# EAGLE board Mini_VFD_RevA (EAGLE 9.6.2)
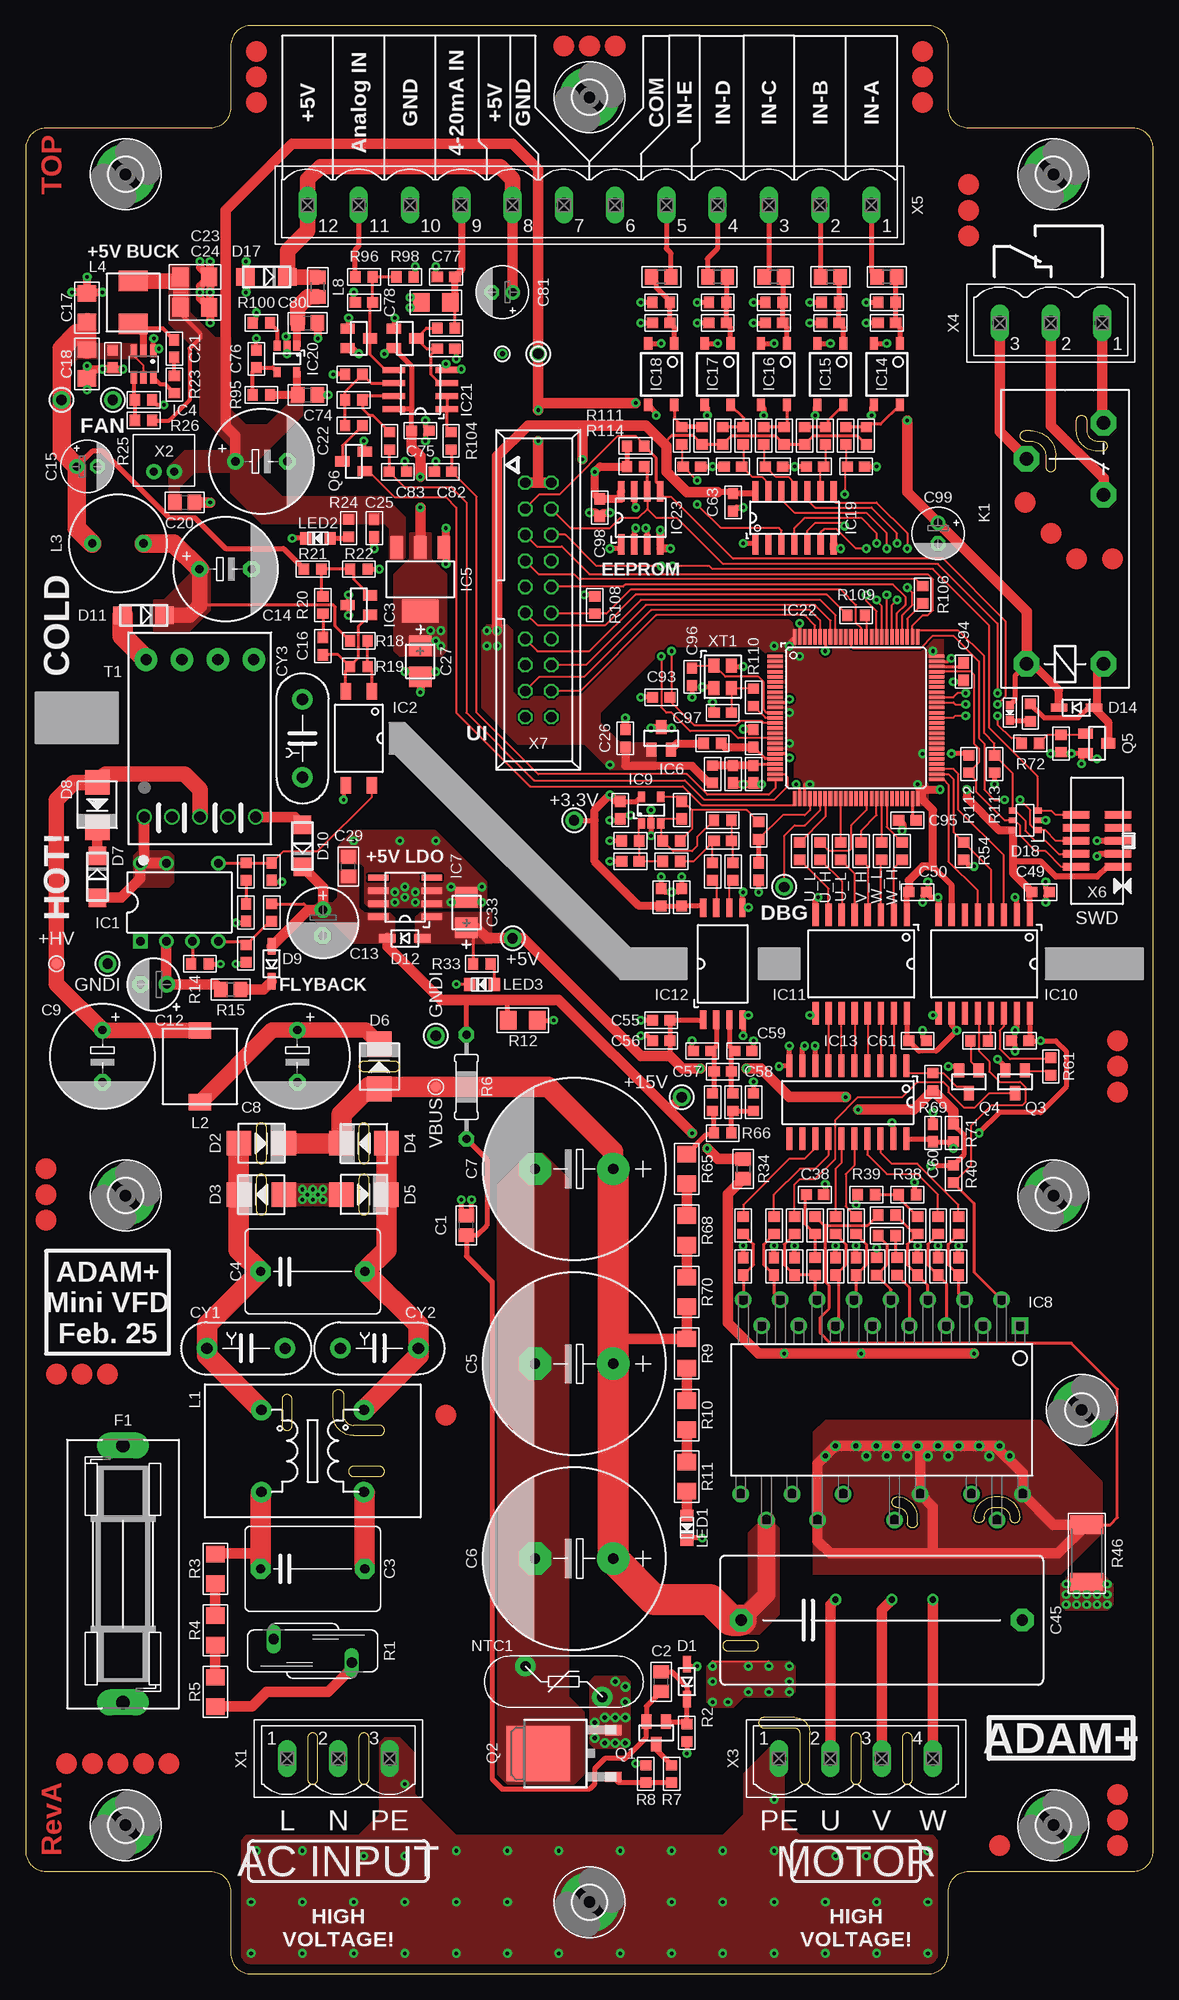
[diagram p7: board, top side]
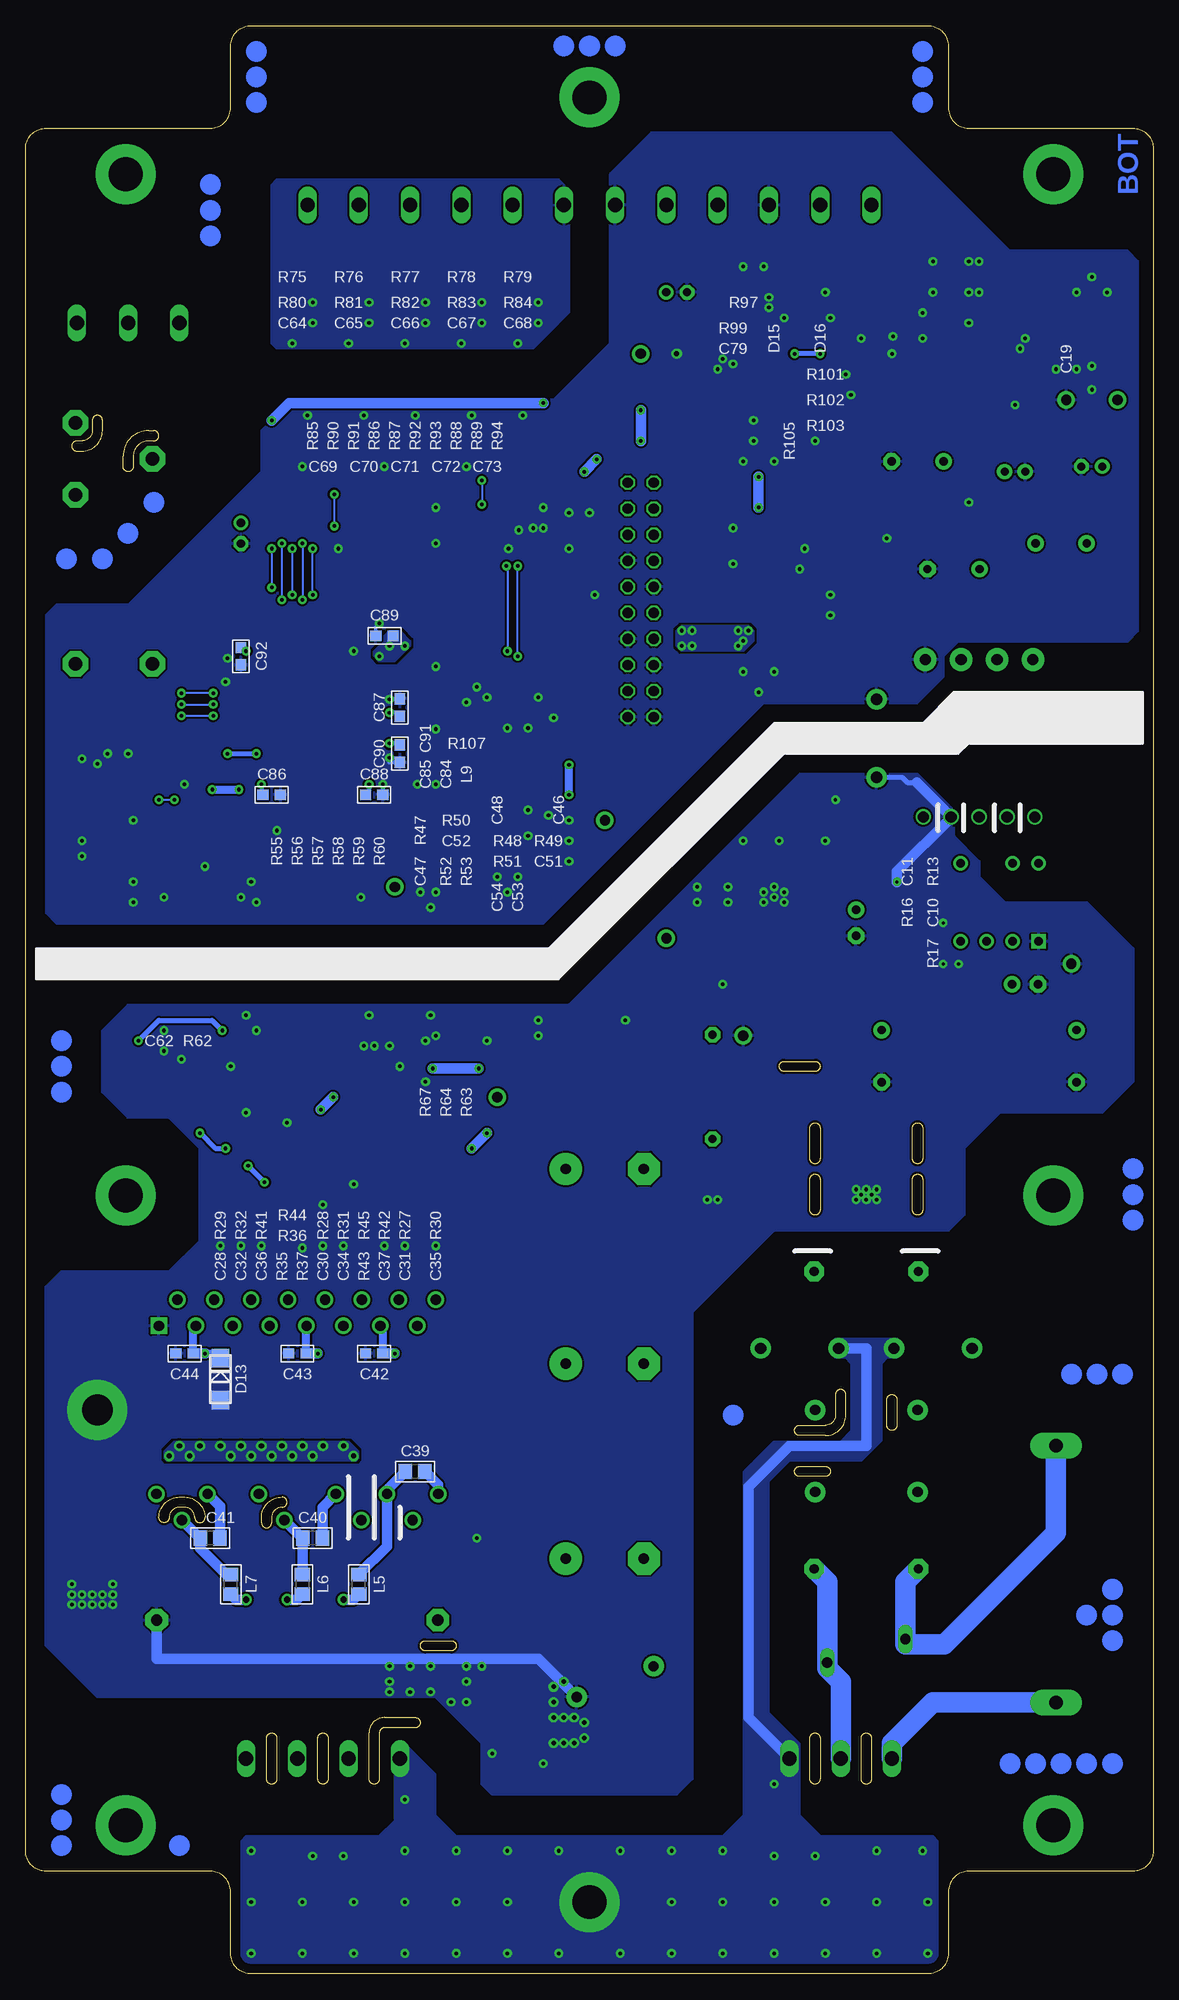
[diagram p8: board, bottom side, seen from below]

Size 110 x 190 mm. Coordinates in mm from the lower left corner, seen from the top.
Outline: 0,12 arc90 2,10 18,10 arc-90 20,8 20,2 arc90 22,0 88,0 arc90 90,2 90,8 arc-90 92,10 108,10 arc90 110,12 110,178 arc90 108,180 92,180 arc-90 90,182 90,188 arc90 88,190 22,190 arc90 20,188 20,182 arc-90 18,180 2,180 arc90 0,178 0,12
Outline: 32,48.5 34.5,48.5 arc90 35,49 arc90 34.5,49.5 32,49.5 arc90 31.5,49 arc90 32,48.5
Outline: 32,52.5 34.5,52.5 arc90 35,53 arc90 34.5,53.5 32,53.5 arc-90 31,54.5 31,56.5 arc90 30.5,57 arc90 30,56.5 30,54.5 arc90 32,52.5
Outline: 26,53.5 26,56 arc90 25.5,56.5 arc90 25,56 25,53.5 arc90 25.5,53 arc90 26,53.5
Outline: 68.5,31.5 71,31.5 arc90 71.5,32 arc90 71,32.5 68.5,32.5 arc90 68,32 arc90 68.5,31.5
Outline: 72,24 75,24 arc-90 75.5,23.5 75.5,19 arc90 76,18.5 arc90 76.5,19 76.5,23.5 arc90 75,25 72,25 arc90 71.5,24.5 arc90 72,24
Outline: 93.5,44.5 arc-90 93,44 arc-90 92.5,44.5 arc-90 94.5,46.5 95,46.5 arc-90 97,44.5 arc-90 96.5,44 arc-90 96,44.5 arc90 95,45.5 94.5,45.5 arc90 93.5,44.5
Outline: 85,45.5 arc-90 84.5,46 arc-90 85,46.5 arc-90 87,44.5 87,44 arc-90 86.5,43.5 arc-90 86,44 86,44.5 arc90 85,45.5
Outline: 23.5,79.5 23.5,82.5 arc90 23,83 arc90 22.5,82.5 22.5,79.5 arc90 23,79 arc90 23.5,79.5
Outline: 23.5,74.5 23.5,77.5 arc90 23,78 arc90 22.5,77.5 22.5,74.5 arc90 23,74 arc90 23.5,74.5
Outline: 33,88 36,88 arc90 36.5,88.5 arc90 36,89 33,89 arc90 32.5,88.5 arc90 33,88
Outline: 33.5,79.5 33.5,82.5 arc90 33,83 arc90 32.5,82.5 32.5,79.5 arc90 33,79 arc90 33.5,79.5
Outline: 33.5,74.5 33.5,77.5 arc90 33,78 arc90 32.5,77.5 32.5,74.5 arc90 33,74 arc90 33.5,74.5
Outline: 27.5,23 27.5,19 arc90 28,18.5 arc90 28.5,19 28.5,23 arc90 28,23.5 arc90 27.5,23
Outline: 32.5,23 32.5,19 arc90 33,18.5 arc90 33.5,19 33.5,23 arc90 33,23.5 arc90 32.5,23
Outline: 80.5,23 80.5,19 arc90 81,18.5 arc90 81.5,19 81.5,23 arc90 81,23.5 arc90 80.5,23
Outline: 85.5,23 85.5,19 arc90 86,18.5 arc90 86.5,19 86.5,23 arc90 86,23.5 arc90 85.5,23
Outline: 97.5,149.5 98,149.5 arc-90 99.5,148 99.5,147 arc90 100,146.5 arc90 100.5,147 100.5,148 arc90 98,150.5 97.5,150.5 arc90 97,150 arc90 97.5,149.5
Outline: 103.5,151.5 103.5,150.5 arc90 104.5,149.5 105,149.5 arc-90 105.5,149 arc-90 105,148.5 104.5,148.5 arc-90 102.5,150.5 102.5,151.5 arc-90 103,152 arc-90 103.5,151.5
Copper layers (1*16): Top 0.035mm / dielectric 1.5mm / Bottom 0.035mm
Design rules "PCB-POOL Standard *": minimum track width 0.2mm, minimum drill 0.3mm, track to track 0.2mm, track to pad 0.2mm, pad to pad 0.2mm, via to via 0.2mm, smd to smd 0.2mm, copper to edge 0.25mm, drill to drill 0.2mm, minimum pad ring 0.2mm, minimum via ring 0.25mm, stop-mask expansion 0.03mm, vias tented up to drill 0.5mm, thermal gap 0.2mm
Net classes: 0 default: width 0.15 mm, drill 0.2 mm, clearance 0.2 mm; 1 High_Voltage: width 0.2 mm, drill 0.2 mm, clearance 2.5 mm to class 0, clearance 2.5 mm

## Footprints (pad centres in the part's own frame; a part is rotated, then mirrored left to right if it is on the bottom)
C0805 = smd 1.3 x 1.5: 1 -0.95,0; 2 0.95,0
C102-082X133 = drill 0.9 pad 1.93 octagon: 1 -5.08,0; 2 5.08,0
E7,5-18 = drill 1.016 pad 3.15: + -3.81,0 | drill 1.016 pad 3.15 octagon: - 3.81,0
E5-10,5 = drill 0.8 pad 1.6: + -2.54,0 | drill 0.8 pad 1.6 octagon: - 2.54,0
C0603 = smd 1.1 x 1: 1 -0.85,0; 2 0.85,0
E2,5-5 = drill 0.813 pad 1.6: + -1.27,0 | drill 0.813 pad 1.6 octagon: - 1.27,0
E2,5-7 = drill 0.813 pad 1.6: + -1.27,0 | drill 0.813 pad 1.6 octagon: - 1.27,0
E2-5 = drill 0.8 pad 1.422: + -1.016,0 | drill 0.8 pad 1.422 octagon: - 1.016,0
C1206 = smd 1.6 x 1.8: 1 -1.4,0; 2 1.4,0
CT3528 = smd 2 x 2.2: + -1.5,0; - 1.5,0
C275-126X316 = drill 1.1 pad 2.2 octagon: 1 -13.716,0; 2 13.716,0
YC7B5 = drill 1.1 pad 2: 1 -3.81,0; 2 3.81,0
SOD123 = smd 1.6 x 0.8: 1 -1.7,0; 2 1.7,0
SMB = smd 2.4 x 2.4: A 2.2,0; C -2.2,0
DO214AC = smd 1.8 x 1.7: A 2.05,0; C -2.05,0
SOT23 = smd 1 x 1.4: 1 -0.95,-1.1; 2 0.95,-1.1; 3 0,1.1
TSOP-6 = smd 0.8 x 0.55: 1 -1.2,0.95; 2 -1.2,0; 3 -1.2,-0.95; 4 1.2,-0.95; 5 1.2,0; 6 1.2,0.95
SH25 = drill 1.321 pad 2.54 long: 1 -12.522,0; 2 12.522,0
3,3-PAD = drill 3.3 pad 5.842: B3,3 0,0
3,0-PAD = drill 3 pad 5.842: B3,0 0,0
DIL07 = drill 0.813 pad 1.4 square: 1 -3.81,-3.81 | drill 0.813 pad 1.4: 2 -1.27,-3.81; 3 1.27,-3.81; 4 3.81,-3.81; 5 3.81,3.81; 7 -1.27,3.81; 8 -3.81,3.81
SMD4 = smd 1 x 1.6: 1 -1.27,-4.575; 2 1.27,-4.575; 3 1.27,4.575; 4 -1.27,4.575
TSOT23-6 = smd 0.62 x 1.22: 1 -0.95,-1.3; 2 0,-1.3; 3 0.95,-1.3; 4 0.95,1.3; 5 0,1.3; 6 -0.95,1.3
SOT223 = smd 1.219 x 2.235: 1 -2.311,-3.099; 2 0,-3.099; 3 2.311,-3.099 | smd 3.6 x 2.2: 4 0,3.099
SOIC8 = smd 0.6 x 2: 1 -1.905,-2.6; 2 -0.635,-2.6; 3 0.635,-2.6; 4 1.905,-2.6; 5 1.905,2.6; 6 0.635,2.6; 7 -0.635,2.6; 8 -1.905,2.6
NDIP26_12P45X29P25_STM = drill 1 pad 1.6 square: 1 -8.2,13.5 | drill 1 pad 1.6: 2 -10.74,11.7; 3 -8.2,9.9; 4 -10.74,8.1; 5 -8.2,6.3; 6 -10.74,4.5; 7 -8.2,2.7; 8 -10.74,0.9; 9 -8.2,-0.9; 10 -10.74,-2.7; 11 -8.2,-4.5; 12 -10.74,-6.3; 13 -8.2,-8.1; 14 -10.74,-9.9; 15 -8.2,-11.7; 16 -10.74,-13.5; 17 8.2,-13.75; 18 10.76,-11.25; 19 8.2,-8.75; 20 10.76,-6.25; 21 8.2,-3.75; 22 10.76,1.25; 23 8.2,3.75; 24 8.2,8.75; 25 10.76,11.25; 26 8.2,13.75
SOT23-5 = smd 0.69 x 0.99: 1 -0.95,-1.29; 2 0,-1.29; 3 0.95,-1.29; 4 0.95,1.3; 5 -0.95,1.3
SOIC16R = smd 0.6 x 2.2: 1 -4.445,-4.775; 2 -3.175,-4.775; 3 -1.905,-4.775; 4 -0.635,-4.775; 5 0.635,-4.775; 6 1.905,-4.775; 7 3.175,-4.775; 8 4.445,-4.775; 9 4.445,4.8; 10 3.175,4.8; 11 1.905,4.8; 12 0.635,4.8; 13 -0.635,4.8; 14 -1.905,4.8; 15 -3.175,4.8; 16 -4.445,4.8
SOIC8_W = smd 1.8 x 0.6: 1 -5.45,1.905; 2 -5.45,0.635; 3 -5.45,-0.635; 4 -5.45,-1.905; 5 5.45,-1.905; 6 5.45,-0.635; 7 5.45,0.635; 8 5.45,1.905
SOIC20NS = smd 0.6 x 2.2: 1 -5.715,-3.565; 2 -4.445,-3.565; 3 -3.175,-3.565; 4 -1.905,-3.565; 5 -0.635,-3.565; 6 0.635,-3.565; 7 1.905,-3.565; 8 3.175,-3.565; 9 4.445,-3.565; 10 5.715,-3.565; 11 5.715,3.565; 12 4.445,3.565; 13 3.175,3.565; 14 1.905,3.565; 15 0.635,3.565; 16 -0.635,3.565; 17 -1.905,3.565; 18 -3.175,3.565; 19 -4.445,3.565; 20 -5.715,3.565
SOP04 = smd 0.8 x 1.2: 1 -1.27,-3; 2 1.27,-3; 3 1.27,3; 4 -1.27,3
SO14 = smd 0.6 x 2: 1 -3.81,-2.6; 2 -2.54,-2.6; 3 -1.27,-2.6; 4 0,-2.6; 5 1.27,-2.6; 6 2.54,-2.6; 7 3.81,-2.6; 8 3.81,2.6; 9 2.54,2.6; 10 1.27,2.6; 11 0,2.6; 12 -1.27,2.6; 13 -2.54,2.6; 14 -3.81,2.6
SO08 = smd 0.6 x 2.2: 1 -1.905,-2.6; 2 -0.635,-2.6; 3 0.635,-2.6; 4 1.905,-2.6; 5 1.905,2.6; 6 0.635,2.6; 7 -0.635,2.6; 8 -1.905,2.6
LQFP100 = smd 1.5 x 0.35: 1 -7.875,6; 2 -7.875,5.5; 3 -7.875,5; 4 -7.875,4.5; 5 -7.875,4; 6 -7.875,3.5; 7 -7.875,3; 8 -7.875,2.5; 9 -7.875,2; 10 -7.875,1.5; 11 -7.875,1; 12 -7.875,0.5; 13 -7.875,0; 14 -7.875,-0.5; 15 -7.875,-1; 16 -7.875,-1.5; 17 -7.875,-2; 18 -7.875,-2.5; 19 -7.875,-3; 20 -7.875,-3.5; 21 -7.875,-4; 22 -7.875,-4.5; 23 -7.875,-5; 24 -7.875,-5.5; 25 -7.875,-6; 51 7.875,-6; 52 7.875,-5.5; 53 7.875,-5; 54 7.875,-4.5; 55 7.875,-4; 56 7.875,-3.5; 57 7.875,-3; 58 7.875,-2.5; 59 7.875,-2; 60 7.875,-1.5; 61 7.875,-1; 62 7.875,-0.5; 63 7.875,0; 64 7.875,0.5; 65 7.875,1; 66 7.875,1.5; 67 7.875,2; 68 7.875,2.5; 69 7.875,3; 70 7.875,3.5; 71 7.875,4; 72 7.875,4.5; 73 7.875,5; 74 7.875,5.5; 75 7.875,6 | smd 0.35 x 1.5: 26 -6,-7.875; 27 -5.5,-7.875; 28 -5,-7.875; 29 -4.5,-7.875; 30 -4,-7.875; 31 -3.5,-7.875; 32 -3,-7.875; 33 -2.5,-7.875; 34 -2,-7.875; 35 -1.5,-7.875; 36 -1,-7.875; 37 -0.5,-7.875; 38 0,-7.875; 39 0.5,-7.875; 40 1,-7.875; 41 1.5,-7.875; 42 2,-7.875; 43 2.5,-7.875; 44 3,-7.875; 45 3.5,-7.875; 46 4,-7.875; 47 4.5,-7.875; 48 5,-7.875; 49 5.5,-7.875; 50 6,-7.875; 76 6,7.875; 77 5.5,7.875; 78 5,7.875; 79 4.5,7.875; 80 4,7.875; 81 3.5,7.875; 82 3,7.875; 83 2.5,7.875; 84 2,7.875; 85 1.5,7.875; 86 1,7.875; 87 0.5,7.875; 88 0,7.875; 89 -0.5,7.875; 90 -1,7.875; 91 -1.5,7.875; 92 -2,7.875; 93 -2.5,7.875; 94 -3,7.875; 95 -3.5,7.875; 96 -4,7.875; 97 -4.5,7.875; 98 -5,7.875; 99 -5.5,7.875; 100 -6,7.875
E3206S = drill 1.3 pad 2.5 octagon: 1 -3,3.75; 2 -3,-3.75; O 13.5,-3.75; P 17,3.75; S 20.5,-3.75
CMC_PDMCAT18107 = drill 1 pad 2: IN1 5,-4; IN2 -5,-4; OUT1 5,4; OUT2 -5,4
SLH0704 = smd 1.6 x 2.2: 1 -3.5,0; 2 3.5,0
PDPTAT = drill 0.8 pad 1.6: 1 -2.5,0; 2 2.5,0
DH0530H = smd 2 x 2.8: P$1 -2.1,0; P$2 2.1,0
R0805 = smd 1.3 x 1.5: 1 -0.95,0; 2 0.95,0
R0603 = smd 1 x 1.1: 1 -0.85,0; 2 0.85,0
LED_0805 = smd 1.1 x 1.25: A 1.2,0; C -1.2,0
LED_0603 = smd 0.8 x 0.8: A 0.75,0; C -0.75,0
MF72 = drill 1 pad 2: 1 -3.75,1.5; 2 3.75,-1.5
TO252 = smd 1.016 x 1.6: 1 -2.28,-4.8; 2 2.28,-4.8 | smd 5.4 x 6.2: 3 0,2.5
S10K175 = drill 1.016 long: 1 -1.143,-3.81; 2 1.143,3.81
R1206 = smd 1.6 x 1.803: 1 -1.422,0; 2 1.422,0
0207/10 = drill 0.8 pad 1.5 octagon: 1 -5.08,0; 2 5.08,0
R2512 = smd 1.8 x 3.2: 1 -2.8,0; 2 2.8,0
WE-OLSTM_EE13_L13.72W20.45H10.8 = drill 1.1: 1 -7.675,5.44; 2 -7.675,2.72; 3 -7.675,0; 4 -7.675,-2.72; 5 -7.675,-5.44 | drill 1.1 pad 2.2: 6 7.675,-5.25; 7 7.675,-1.75; 8 7.675,1.75; 9 7.675,5.25
TP10R = smd 1 x 1: TP 0,0
SOLDER_EYE = drill 1 pad 1.7: 1 0,0
MSTBV3 = drill 1.397 long: 1 -5,0; 2 0,0; 3 5,0
DF3A-2P-2DSA = drill 0.8 pad 1.5: 1 1,0; 2 -1,0
MSTBV4 = drill 1.397 long: 1 -7.5,0; 2 -2.5,0; 3 2.5,0; 4 7.5,0
MSTBV12 = drill 1.397 long: 1 -27.5,0; 2 -22.5,0; 3 -17.5,0; 4 -12.5,0; 5 -7.5,0; 6 -2.5,0; 7 2.5,0; 8 7.5,0; 9 12.5,0; 10 17.5,0; 11 22.5,0; 12 27.5,0
3220-10-0300-00 = smd 0.76 x 2.6: 1 -2.54,-2.05; 2 -2.54,2.05; 3 -1.27,-2.05; 4 -1.27,2.05; 5 0,-2.05; 6 0,2.05; 7 1.27,-2.05; 8 1.27,2.05; 9 2.54,-2.05; 10 2.54,2.05
057-020-1 = drill 1 octagon: 1 -11.43,-1.27; 2 -11.43,1.27; 3 -8.89,-1.27; 4 -8.89,1.27; 5 -6.35,-1.27; 6 -6.35,1.27; 7 -3.81,-1.27; 8 -3.81,1.27; 9 -1.27,-1.27; 10 -1.27,1.27; 11 1.27,-1.27; 12 1.27,1.27; 13 3.81,-1.27; 14 3.81,1.27; 15 6.35,-1.27; 16 6.35,1.27; 17 8.89,-1.27; 18 8.89,1.27; 19 11.43,-1.27; 20 11.43,1.27
3225_4P = smd 1.4 x 1.2: 1 -1.1,-0.85; 2 1.1,-0.85; 3 1.1,0.85; 4 -1.1,0.85

## Placement (x,y rotation side)
C1  4.7uF  [C0805]  43,73 90 top
C2  10uF  [C0805]  62,28.5 90 top
C3  1uF  [C102-082X133]  28,39.5 0 top
C4  1uF  [C102-082X133]  28,68.5 0 top
C5  68uF/450V  [E7,5-18]  53.5,59.5 180 top
C6  68uF/450V  [E7,5-18]  53.5,40.5 180 top
C7  68uF/450V  [E7,5-18]  53.5,78.5 180 top
C8  10uF/450V  [E5-10,5]  26.5,89.5 270 top
C9  10uF/450V  [E5-10,5]  7.5,89.5 270 top
C10  220nF  [C0603]  21.5,103.5 270 top
C11  2.7nF  [C0603]  24,107.5 270 top
C12  10uF  [E2,5-5]  12.5,96.5 180 top
C13  47uF  [E2,5-7]  29,102.5 270 top
C14  470uF  [E5-10,5]  19.5,137 0 top
C15  22uF  [E2-5]  6,147 0 top
C16  18nF  [C0603]  29,129.5 90 top
C17  10uF  [C1206]  6,162.5 90 top
C18  10uF  [C1206]  6,157 270 top
C19  100nF  [C0603]  8.5,157.5 270 top
C20  4.7uF  [C0805]  15.5,143.5 0 top
C21  100nF  [C0603]  14.5,158.5 90 top
C22  470uF  [E5-10,5]  23,147.5 0 top
C23  22uF  [C1206]  16.5,165.5 0 top
C24  22uF  [C1206]  16.5,162.5 0 top
C25  4.7uF  [C0603]  34,141 270 top
C26  4.7uF  [C0603]  58.5,120.5 90 top
C27  10uF  [CT3528]  38.5,128 270 top
C28  1nF  [C0603]  91,69 90 top
C29  2.2uF  [C0805]  31.5,108 90 top
C30  1nF  [C0603]  81,69 90 top
C31  1nF  [C0603]  73,69 90 top
C32  1nF  [C0603]  89,69 90 top
C33  10uF  [CT3528]  43,103.5 90 top
C34  1nF  [C0603]  79,69 90 top
C35  1nF  [C0603]  70,69 90 top
C36  33pF  [C0603]  87,69 90 top
C37  2.2nF  [C0603]  75,69 90 top
C38  22nF  [C0603]  77,76 0 top
C39  2.2uF  [C0805]  72,49 180 bottom
C40  2.2uF  [C0805]  82,42.5 180 bottom
C41  2.2uF  [C0805]  92,42.5 180 bottom
C42  100nF  [C0603]  76,60.5 180 bottom
C43  100nF  [C0603]  83.5,60.5 180 bottom
C44  100nF  [C0603]  94.5,60.5 180 bottom
C45  4.7uF  [C275-126X316]  83.5,34.5 0 top
C46  100nF  [C0603]  58,113.5 270 top
C47  100nF  [C0603]  71.5,107.5 270 top
C48  100nF  [C0603]  64,113.5 270 top
C49  100nF  [C0603]  99,105.5 0 top
C50  100nF  [C0603]  87,105.5 0 top
C51  10nF  [C0603]  59,108.5 180 top
C52  10nF  [C0603]  68,110.5 180 top
C53  4.7uF  [C0603]  62,105 90 top
C54  100nF  [C0603]  64,105 90 top
C55  100nF  [C0603]  62,93 180 top
C56  4.7uF  [C0603]  62,91 180 top
C57  10pF  [C0603]  66,90 0 top
C58  10nF  [C0603]  68,88 0 top
C59  10pF  [C0603]  70,90 0 top
C60  100nF  [C0603]  88.5,82 90 top
C61  100nF  [C0603]  87,91 0 top
C62  100nF  [C0603]  97,91 180 top
C63  100nF  [C0603]  69,143.5 270 top
C64  100nF  [C0603]  84,161 180 top
C65  100nF  [C0603]  78.5,161 180 top
C66  100nF  [C0603]  73,161 180 top
C67  100nF  [C0603]  67.5,161 180 top
C68  100nF  [C0603]  62,161 180 top
C69  100nF  [C0603]  81,147 0 top
C70  100nF  [C0603]  77,147 180 top
C71  100nF  [C0603]  73,147 0 top
C72  100nF  [C0603]  69,147 180 top
C73  100nF  [C0603]  65,147 0 top
C74  10uF  [C0805]  27.5,154 0 top
C75  100nF  [C0603]  38.5,150.5 0 top
C76  1uF  [C0603]  22.5,157.5 90 top
C77  100nF  [C0603]  41,165.5 180 top
C78  100nF  [C0603]  33,163 180 top
C79  100nF  [C0603]  41,158.5 0 top
C80  10uF  [C0805]  27.5,161 0 top
C81  22uF  [E2-5]  46.5,164 180 top
C82  100nF  [C0603]  40.7,146.5 180 top
C83  100nF  [C0603]  36.3,146.5 0 top
C84  1uF  [C0603]  69,117 270 top
C85  100nF  [C0603]  71,117 270 top
C86  100nF  [C0603]  86,115 0 bottom
C87  100nF  [C0603]  73.5,123.5 90 bottom
C88  100nF  [C0603]  76,115 0 bottom
C89  100nF  [C0603]  75,130.5 180 bottom
C90  100nF  [C0603]  73.5,119 270 bottom
C91  100nF  [C0603]  71,120.5 90 top
C92  100nF  [C0603]  89,128.5 270 bottom
C93  100nF  [C0603]  62,124.5 180 top
C94  2.2uF  [C0603]  91.5,127 270 top
C95  2.2uF  [C0603]  86,112.5 180 top
C96  10pF  [C0603]  65,126.5 270 top
C97  10pF  [C0603]  68,123 180 top
C98  100nF  [C0603]  56,143 90 top
C99  22uF  [E2-5]  89,140.5 270 top
CY1  2.2nF  [YC7B5]  21.5,61 0 top
CY2  2.2nF  [YC7B5]  34.5,61 0 top
CY3  2.2nF  [YC7B5]  27,120.5 90 top
D1  BAT54J  [SOD123]  64.5,28.5 90 top
D2  STTH3R04U  [SMB]  23,81 180 top
D3  STTH3R04U  [SMB]  23,76 0 top
D4  STTH3R04U  [SMB]  33,81 0 top
D5  STTH3R04U  [SMB]  33,76 180 top
D6  STTH3R04U  [SMB]  34.5,88.5 270 top
D7  PU1JA  [DO214AC]  7,107 270 top
D8  SMBJP6KE200A-TP  [SMB]  7,114 90 top
D9  BAT54J  [SOD123]  24,98.5 90 top
D10  PU1JA  [DO214AC]  27,110 90 top
D11  PU1JA  [DO214AC]  11.5,132.5 180 top
D12  BAT54J  [SOD123]  37,101 0 top
D13  DNP  [DO214AC]  91,58 270 bottom
D14  1N5819W  [SOD123]  102.5,123.5 0 top
D15  BAV99-7-F  [SOT23]  37,159.5 270 top
D16  BAV99-7-F  [SOT23]  32.5,159.5 270 top
D17  6V  [DO214AC]  23.5,165.5 180 top
D18  PESD3V3S5UD,125  [TSOP-6]  97.5,112.5 180 top
F1  5A  [SH25]  9.5,39 90 top
H1  MOUNT-PAD-ROUND3.3  [3,3-PAD]  9.75,175.5 0 top
H2  MOUNT-PAD-ROUND3.3  [3,3-PAD]  55,7 0 top
H3  MOUNT-PAD-ROUND3.3  [3,3-PAD]  55,183 180 top
H4  MOUNT-PAD-ROUND3.3  [3,3-PAD]  100.25,175.5 180 top
H5  MOUNT-PAD-ROUND3.3  [3,3-PAD]  9.75,14.5 0 top
H6  MOUNT-PAD-ROUND3.3  [3,3-PAD]  9.75,75.9 0 top
H7  MOUNT-PAD-ROUND3.3  [3,3-PAD]  100.25,14.5 0 top
H8  MOUNT-PAD-ROUND3.3  [3,3-PAD]  100.25,75.9 0 top
H9  MOUNT-PAD-ROUND3.0  [3,0-PAD]  103,55 0 top
IC1  VIPER06HN  [DIL07]  15,104.5 0 top
IC2  CT817C  [SMD4]  32.5,120.5 180 top
IC3  AN431AN  [SOT23]  32.5,133.5 90 top
IC4  TPS56339  [TSOT23-6]  11.5,157 180 top
IC5  SPX1117M3  [SOT223]  38.5,136 180 top
IC6  REF3025AIDBZR  [SOT23]  62,120.5 0 top
IC7  L78L05A  [SOIC8]  37,105 90 top
IC8  STGIPN3H60  [NDIP26_12P45X29P25_STM]  83.5,55 270 top
IC9  MCP6006U  [SOT23-5]  61,113.5 0 top
IC10  π131E60  [SOIC16R]  93.5,98.5 180 top
IC11  π160E60  [SOIC16R]  81.5,98.5 180 top
IC12  AMC1200  [SOIC8_W]  68,98.5 90 top
IC13  74ACT541  [SOIC20NS]  80.2,85 180 top
IC14  LTV-354T  [SOP04]  84,156 180 top
IC15  LTV-354T  [SOP04]  78.5,156 180 top
IC16  LTV-354T  [SOP04]  73,156 180 top
IC17  LTV-354T  [SOP04]  67.5,156 180 top
IC18  LTV-354T  [SOP04]  62,156 180 top
IC19  SN74LVC14ADR  [SO14]  75,142 0 top
IC20  SY6280AAC  [SOT23-5]  25.5,157.5 180 top
IC21  MCP6272T-E/SN  [SO08]  38.5,154.5 90 top
IC22  STM32F407VGT7  [LQFP100]  81,122.5 0 top
IC23  AT34C04-SS5M-T  [SOIC8]  60,142 0 top
K1  G2RL-1-HA DC5  [E3206S]  101.39,130.75 90 top
L1  22mH  [CMC_PDMCAT18107]  28,51 180 top
L2  1mH  [SLH0704]  17,88.5 270 top
L3  56uH  [PDPTAT]  9,139.5 0 top
L4  5.6uH  [DH0530H]  10.5,163 270 top
L5  BLM21PG331BH1D  [R0805]  77.5,38 270 bottom
L6  BLM21PG331BH1D  [R0805]  83,38 270 bottom
L7  BLM21PG331BH1D  [R0805]  90,38 270 bottom
L8  BLM21PG331BH1D  [R0805]  28.5,164.5 90 top
L9  1K  [R0603]  67,117 270 top
LED1  RED  [LED_0805]  64.5,43.5 90 top
LED2  GREEN  [LED_0805]  28.5,140 0 top
LED3  GREEN  [LED_0805]  44.5,96.5 0 top
LED4  ORANGE  [LED_0603]  96,123 90 top
NTC1  MF72 30D15  [MF72]  52.5,28.5 180 top
Q1  DMP1045  [SOT23]  61.5,23.5 180 top
Q2  IPD60R360P7S  [TO252]  52.5,21.5 90 top
Q3  DMN2046  [SOT23]  96.5,87 180 top
Q4  DMN2046  [SOT23]  92,87 180 top
Q5  DMN2046  [SOT23]  104.5,120 270 top
Q6  DMN2046  [SOT23]  32,147.5 90 top
R1  10D561K  [S10K175]  28,31.5 90 top
R2  560k  [R0603]  64.5,23.5 90 top
R3  220k  [R1206]  18.5,39.5 90 top
R4  220k  [R1206]  18.5,33.5 90 top
R5  220k  [R1206]  18.5,27.5 90 top
R6  15R  [0207/10]  43,86.5 90 top
R7  1k  [R0603]  63,19.5 90 top
R8  10k  [R0603]  60.5,19.5 270 top
R9  220k  [R1206]  64.5,60.5 90 top
R10  220k  [R1206]  64.5,54.5 90 top
R11  220k  [R1206]  64.5,48.5 90 top
R12  4.7k  [R1206]  48.5,93 180 top
R13  15k  [R0603]  21.5,107.5 90 top
R14  22k  [R0603]  17,98.5 180 top
R15  10R  [R0805]  20,96 0 top
R16  36k  [R0603]  24,103.5 90 top
R17  10k  [R0603]  21.5,99.5 90 top
R18  8.2k  [R0603]  32.5,130 180 top
R19  3k  [R0603]  32.5,127.5 0 top
R20  200k  [R0603]  29,133.5 90 top
R21  56k  [R0603]  28,137 180 top
R22  56k  [R0603]  32.5,137 180 top
R23  30R  [R0603]  14.5,155 90 top
R24  4.7k  [R0603]  31.5,141 90 top
R25  52.3k  [R0603]  11.5,151.5 0 top
R26  10k  [R0603]  11.5,153.5 180 top
R27  100R  [R0603]  73,73 270 top
R28  100R  [R0603]  81,73 270 top
R29  100R  [R0603]  91,73 270 top
R30  100R  [R0603]  70,73 270 top
R31  100R  [R0603]  79,73 270 top
R32  100R  [R0603]  89,73 270 top
R33  4.7k  [R0603]  44.5,98.5 180 top
R34  1R  [R0805]  70,78.5 270 top
R35  2.7k  [R0603]  85,69 270 top
R36  2.7k  [R0603]  84,72 0 top
R37  1k  [R0603]  83,69 270 top
R38  1k  [R0603]  86,76 0 top
R39  910R  [R0603]  82,76 0 top
R40  10k  [R0603]  90.5,78 90 top
R41  910R  [R0603]  87,73 270 top
R42  1k  [R0603]  75,73 270 top
R43  1k  [R0603]  77,69 90 top
R44  910R  [R0603]  84,74 180 top
R45  22R  [R0603]  77,73 90 top
R46  0.47R  [R2512]  103.5,41 90 top
R47  100R  [R0603]  71.5,111.5 270 top
R48  15k  [R0603]  63,110.5 0 top
R49  15k  [R0603]  59,110.5 0 top
R50  4.7k  [R0603]  68,112.5 180 top
R51  4.7k  [R0603]  63,108.5 180 top
R52  4.7k  [R0603]  69,107.5 90 top
R53  4.7k  [R0603]  67,107.5 90 top
R54  10k  [R0603]  91.5,109.5 90 top
R55  22R  [R0603]  85.5,109.5 270 top
R56  22R  [R0603]  83.5,109.5 270 top
R57  22R  [R0603]  81.5,109.5 270 top
R58  22R  [R0603]  79.5,109.5 270 top
R59  22R  [R0603]  77.5,109.5 270 top
R60  22R  [R0603]  75.5,109.5 270 top
R61  10R  [R0603]  100,88.5 270 top
R62  10R  [R0603]  93,91 180 top
R63  10R  [R0603]  67,85 90 top
R64  10R  [R0603]  69,85 90 top
R65  330k  [R1206]  64.5,78.5 270 top
R66  240R  [R0603]  68,82 180 top
R67  100R  [R0603]  71,85 270 top
R68  330k  [R1206]  64.5,72.5 90 top
R69  22k  [R0603]  88.5,87 270 top
R70  330k  [R1206]  64.5,66.5 270 top
R71  10R  [R0603]  90.5,82 90 top
R72  100R  [R0603]  98,120 0 top
R73  470R  [R0603]  98,123 270 top
R74  10k  [R0603]  101,120 270 top
R75  4.7k  [R0805]  84,165.5 0 top
R76  4.7k  [R0805]  78.5,165.5 0 top
R77  4.7k  [R0805]  73,165.5 0 top
R78  4.7k  [R0805]  67.5,165.5 0 top
R79  4.7k  [R0805]  62,165.5 180 top
R80  1k  [R0603]  84,163 0 top
R81  1k  [R0603]  78.5,163 0 top
R82  1k  [R0603]  73,163 0 top
R83  1k  [R0603]  67.5,163 0 top
R84  1k  [R0603]  62,163 0 top
R85  10k  [R0603]  82,150 270 top
R86  10k  [R0603]  76,150 270 top
R87  10k  [R0603]  74,150 270 top
R88  10k  [R0603]  68,150 270 top
R89  10k  [R0603]  66,150 270 top
R90  10k  [R0603]  80,150 270 top
R91  10k  [R0603]  78,150 270 top
R92  10k  [R0603]  72,150 270 top
R93  10k  [R0603]  70,150 270 top
R94  10k  [R0603]  64,150 270 top
R95  1k  [R0603]  23,154 0 top
R96  15k  [R0603]  33,165.5 0 top
R97  120R  [R1206]  40,163 0 top
R98  4.99k  [R0603]  37,165.5 180 top
R99  10k  [R0603]  41,160.5 180 top
R100  13.7k  [R0603]  23,161 0 top
R101  DNP  [R0603]  32,156 0 top
R102  10k  [R0603]  32,153.5 0 top
R103  10k  [R0603]  32,151 180 top
R104  10k  [R0603]  41.5,149.5 270 top
R105  10k  [R0603]  35.5,149.5 270 top
R106  22R  [R0603]  87.5,134.5 270 top
R107  10R  [R0603]  67,120 0 top
R108  47k  [R0603]  55.5,133.5 270 top
R109  22R  [R0603]  81,132.5 180 top
R110  100R  [R0603]  71,124.5 270 top
R111  4.7k  [R0603]  59.5,149 180 top
R112  47k  [R0603]  92,118 90 top
R113  47k  [R0603]  94.5,118 90 top
R114  4.7k  [R0603]  59.5,147 180 top
T1  750370024  [WE-OLSTM_EE13_L13.72W20.45H10.8]  17,120.5 90 top
TP1  TPTP10R  [TP10R]  40,86.5 270 top
TP2  TPTP10R  [TP10R]  3,98.5 180 top
TP3  TP_SOLDREYE  [SOLDER_EYE]  40,91.5 180 top
TP4  TP_SOLDREYE  [SOLDER_EYE]  8,98.5 180 top
TP5  TP_SOLDREYE  [SOLDER_EYE]  8.5,153.5 180 top
TP6  TP_SOLDREYE  [SOLDER_EYE]  3.5,153.5 180 top
TP7  TP_SOLDREYE  [SOLDER_EYE]  74,106 0 top
TP8  TP_SOLDREYE  [SOLDER_EYE]  50,158 0 top
TP9  TP_SOLDREYE  [SOLDER_EYE]  53.5,112.5 180 top
TP10  TP_SOLDREYE  [SOLDER_EYE]  64,85.5 180 top
TP11  TP_SOLDREYE  [SOLDER_EYE]  47.5,101 180 top
X1  MSTBV3  [MSTBV3]  30.5,21 0 top
X2  DF3A-2P-2DSA  [DF3A-2P-2DSA]  13.5,146.5 0 top
X3  MSTBV4MTSV  [MSTBV4]  81,21 0 top
X4  MSTBV3  [MSTBV3]  100,161 180 top
X5  [MSTBV12]  55,172.5 180 top
X6  3220-10-0300-00  [3220-10-0300-00]  104.5,110.5 90 top
X7  057-020-1  [057-020-1]  50,134 270 top
XT1  16MHz  [3225_4P]  68,126.5 270 top

## Tracks (layer width: path | path; a pad name or v marks a point on that pad's centre or on a via)
0...10V_RNG
  Top 0.2: Q6.1 33.45,146.55 36,144 41,144 42,143 42,123 49.2,115.8 64.1,115.8 65.9,114 75,114 IC22.26
!DISP_CS
  Top 0.2: IC22.77 86.5,131.5 87.5,132.5 88,132.5 88.5,133 88.5,136 88,136.5 55,136.5 52.3,139.2 49.88,139.2 X7.5
!EMERGENCY
  Top 0.2: IC10.5 92.87,105.64 90,108.5 90,116 89.5,116.5 IC22.51
!EMERGENCY_ISO
  Top 0.2: IC10.12 93,93.56 93,90 94,89 94,88 95,87 97,87 97.5,86.5 97.5,85 97.2,84.7 94.2,84.7 92.2,82.7 92.2,78.85 R40.1
  Top 0.3: IC8.2 92.5,68.44 92.5,75.15 R40.1
!INPUT_A
  Top 0.3: IC14.4 83.39,151.12 82.27,151.12 R85.1 R90.1
!INPUT_A_FILT  (via drill 0.35)
  Top 0.2: R90.2 80,147.15 C69.1 79.9,147 v79.9,144.3 | IC19.5 76.27,140.77 77,141.5 79.6,141.5 v79.9,141.2
  Bottom 0.2: v79.9,144.3 v79.9,141.2
!INPUT_B
  Top 0.3: R86.1 R91.1 78.27,151.12 78.27,151.5 IC15.4
!INPUT_B_FILT
  Top 0.2: R91.2 78,147.15 77.92,147.07 77.54,146.69 IC19.9
  Top 0.3: 77.92,147.07 C70.1
!INPUT_C
  Top 0.3: IC16.4 74.27,151.12 R87.1 R92.1
!INPUT_C_FILT
  Top 0.2: R92.2 72,147.15 C71.1 73.15,146 74.4,146 75,145.4 IC19.11
!INPUT_D
  Top 0.3: R88.1 R93.1 70,151.77 IC17.4
!INPUT_D_FILT
  Top 0.2: R93.2 70,147.15 C72.1 70.85,146 71.8,146 72.5,145.3 72.5,144.64 IC19.13
!INPUT_E
  Top 0.3: IC18.4 63.27,151.73 64,151 66.15,151 R89.1 R94.1
!INPUT_E_FILT  (via drill 0.35)
  Top 0.2: R94.2 64,147.15 C73.1 v65.5,145.65 | IC19.3 73.73,140.77 73.5,141 67.8,141 v65.5,143.3
  Bottom 0.2: v65.5,145.65 v65.5,143.3
!INT
  Top 0.2: IC22.96 77,131.5 76,132.5 61.5,132.5 54.11,125.11 X7.18
!OC_BOOST
  Top 0.2: R42.1 75,77 75.5,77.5 77,77.5 78.97,79.47 78.97,83.27 81.2,85.5 85.5,85.5 87,87 89.5,87 90,86.5 90,86 91.5,84.5 92.6,84.5 94,85.9 Q3.3
!OE_ISO
  Top 0.2: IC13.1 85.91,87.85 R69.1 89.5,87.85 90.85,86.5 92,86.5 Q4.3
+3.3V  (via drill 0.35)
  Top 0.3: IC22.28 76,116 v76.5,116 | IC22.50 v87,116 | R85.2 81.15,150 76.85,150 R86.2 R87.2 73.15,150 68.85,150 R88.2 R89.2 65.15,150 63,150 62.25,149.25
  Top 0.35: IC22.100 74.5,129.88 v74.5,129.5
  Top 0.5: C46.1 59.6,114.35 IC9.5 | IC12.8 65.89,104.15 C54.1 C53.1 | R111.2 R114.2 | 87.5,115.5 v87,116 | R112.2 91.85,119 v90.3,119 | 37.65,152.59 IC21.8 | 37.65,152.59 37.65,156.8 D15.2 35.55,158.55 v35,158 | D16.2 31.95,158.55 v32.5,158 | C75.1 37.65,152.59 | TP9.1 55.5,112.5
  Top 0.6: IC11.1 85.94,105.3 C50.1 | IC10.1 97.94,105.3 C49.1 | IC10.7 90.33,106.17 88.5,108 | X6.1 105.46,107.96 104.5,107 100.5,107 99,108.5 96.3,108.5 | 87.5,115.5 87.5,114.5 | IC19.14 70.94,144.35 C63.1 68.85,144.5 67.5,144.5
  Top 0.8: R114.2 56,147 v55.5,146.5 55.5,144.35 C98.2 58.09,143.85 IC23.8 | C50.1 86.15,106.65 87.5,108 88.5,108 88.5,113.5 87.5,114.5 | L9.2 66.65,116.15 65,117.8 58.5,117.8 C26.1 | C49.1 96.3,107.35 96.3,108.5 D18.6 94.95,111.55 91.8,114.7 v91.8,115.5 | 87.5,115.5 v89.2,115.5 | C46.1 57.65,114.35 v57,115 55.5,113.5 55.5,112.5 55.5,108.5 59.85,104.15 C53.1
  Top 1: v54.3,147.7 54.3,151 | 54.3,151 49,151 46,148 v46,131 | 54.3,151 60.5,151 62.25,149.25 62.5,149 62.5,146.5 64.5,144.5 67.5,144.5 | IC5.2 v38.5,143 | v38.5,146 38.5,148 37.65,148.85 C75.1
  Bottom 0.4: C87.1 73.85,123 v74.5,123 | v74.5,129.5 74.5,130.15 C89.1 | C90.1 73.5,120 v74.5,120 | v76.5,116 76.5,115.35 C88.1 | v87,116 87,115.15 C86.1 | C92.1 88.65,129 v88.5,129
  Bottom 0.5: v90.3,119 v87.5,119 | v32.5,158 v35,158
  Bottom 0.8: v91.8,115.5 v89.2,115.5 | v57,115 v57,117.9
  Bottom 1: v55.5,146.5 v54.3,147.7 | v38.5,143 v38.5,146
  other vias: 75.5,128.5 73,129.5 40.5,131 40.5,129.5 40,130 39.5,131 45,131 45,129.5 46,129.5
  pour Top (no thermals): 72.5,119 75,119 75,114 88,114 88,128 89.5,128 89.5,131 75.5,131 74.5,132 61.5,132 54,124.5 48,124.5 47.5,125 47.5,131 47,131.5 45,131.5 44.5,131 44.5,123.5 48,120 54.5,120 57,117.5 61.5,117.5 61.5,120 58,120 56,122 56,123 62.5,129.5 71.5,129.5 72.5,128.5
  pour Bottom (no thermals): 74.5,131 73.5,131 72.5,130 72.5,129.5 74,128 75.5,128 76,128.5 76,129 75,130 75,130.5
  pour Top (no thermals): 37.5,138 37.5,140.5 39.5,140.5 39.5,138 41,136.5 41,129 40.5,128.5 36.5,128.5 36,129 36,136.5
  pour Bottom (no thermals): 46,131.5 39.5,131.5 39,131 39,130 40,129 46,129 46.5,129.5 46.5,131
+3.3V_FILT
  Top 0.3: C85.1 71.15,118 IC22.22
  Top 0.8: C85.1 C84.1 L9.1
+5V  (via drill 0.35)
  Top 0.4: R25.2 14,151.5 16,153.5 16,158.5 17,159.5 17,160 15.1,161.9 C24.1
  Top 0.5: LED4.A 96.5,124.25 96.5,126.61 K1.1
  Top 0.8: D14.1 100.8,125.2 98.25,127.75 K1.1 | IC20.5 26.45,154.1 C74.1 R95.2
  Top 1: X7.1 50,145.43 | 50,145.43 X7.2 | C22.+ 20.46,150 19.5,150.96 19.5,172 26,178.5 47.5,178.5 50,176 TP8.1 50,153.2 | v50,149.5 50,145.43 | K1.1 97.64,132.86 89.5,141 | v50,152.5 50,153.2 | v59.5,153.2 50,153.2 | 89.5,141 86,144.5 v86,151.5 | C99.+ 89.5,141.02 89.5,141
  Top 1.5: L4.P$1 14.7,165.1 C23.1 C24.1
  Bottom 1: v50,152.5 v50,149.5 | v86,151.5 84.3,153.2 v59.5,153.2
  pour Top (rank 2, no thermals): 14,161 17,158 17,152 20,149 20,148.5 15.5,148.5 14,147 14,143 15,143 15,145 16.5,146.5 20,146.5 20,144.5 23,141.5 35,141.5 35.5,141 35.5,138 37,138 37,142 35,144 25,144 22.5,146.5 22.5,147.5 27,152 27,154.5 26,154.5 26,153.5 23.5,151 21.5,151 20,152.5 20,159.5 18.5,159.5 16,162 16,166.5 14,166.5
+5V_D  (via drill 0.35)
  Top 0.2: TP11.1 47,101
  Top 0.3: C33.+ 43.65,101.35 R33.2
  Top 0.5: v86.7,77.2 86.7,76.15 R38.2 | R71.2 91.5,81.85 91.5,79.85 R40.2 90.45,78.8 v88.3,78.8 | IC12.1 62.9,93.05 C55.1 C56.1 62.85,89.5
  Top 1: R71.2 90.5,84.15 R69.2 86.64,84.29 v81.21,84.29 | C33.+ 44,102 45,101 47,101 48.5,101 60,89.5 62.85,89.5 64.05,88.3 v65.8,88.3 | v70.3,88.3 71.7,88.3 74.49,85.51 v79.99,85.51
  Bottom 0.5: v88.3,78.8 v86.7,77.2
  Bottom 1: v81.21,84.29 v79.99,85.51 | v70.3,88.3 v65.8,88.3
  pour Top (no thermals): 40,103.5 38.5,103.5 38,103 38,100.5 45.5,100.5 45.5,103.5
+5V_FILT  (via drill 0.35)
  Top 0.5: IC13.20 88.22,81.44 C60.1 R71.1 v90.5,80.5 | IC10.16 97.94,91.09 C62.1 v99,91 100.5,91 101.5,90 101.5,86.5 99,84 95,84 v93,82 | IC11.16 85.94,91.2 C61.1 87.15,90 88.83,90 v90.83,92 90.33,92.5 IC10.10
  Bottom 0.5: v93,82 91.5,80.5 v90.5,80.5 | v99,91 97,93 91.83,93 v90.83,92
+5V_OUT
  Top 1: C81.+ 47.52,172.48 X5.8
  Top 1.5: L8.2 25.6,165.45 D17.C 25.55,168.05 27.5,170 X5.12 27.5,175 28.75,176.25 46.25,176.25 47.5,175 X5.8
+15V  (via drill 0.35)
  Top 0.3: R16.2 27.15,104.35 27.73,103.77 C13.+
  Top 0.5: R6.2 43,95 | R12.2 47,93.08 47,95
  Top 1: D10.C 29,105.95 C13.+ 27.57,103.77 D9.2 | D12.1 35.3,100.2 40.5,95 43,95 47,95 52,95 62.75,84.25 | 62.75,84.25 v65,82 | R34.1 67.55,79.45 v66.5,80.5 | TP10.1 62.75,84.25
  Bottom 1: v66.5,80.5 v65,82
  pour Top (no thermals): 28.5,104.5 30,104.5 30.5,105 30.5,107.5 30.7,107.7 32.3,107.7 32.5,107.5 32.5,104 33,103.5 35.5,103.5 36,103 36,100.5 32,100.5 30,102.5 28.5,102.5 28,103 28,104
+HV
  Top 1.5: T1.3 17,115.5 15.5,117 7.8,117 D8.A 4.7,116.2 3,114.5 TP2.TP 3,96.54 C9.+ 7.54,92 L2.1
AIN_ADC
  Top 0.2: C82.1 44,144.05 44,123 50,117 64.5,117 66.5,115 72.5,115 73.12,115.62 IC22.25
  Top 0.3: R104.2 41.55,148.6 C82.1
AUX_OUT
  Top 1: T1.5 26.23,112.83 D10.A
BOOT_+5V
  Top 0.4: IC4.6 13.15,155 13.65,155 R23.1
BOOT_U
  Bottom 1: C39.1 69.75,47.7 IC8.17
BOOT_V
  Bottom 1: IC8.21 81.05,45.5 C40.1
BOOT_W
  Bottom 1: IC8.24 91.05,45.6 C41.1
C_NEG
  pour Top (no thermals): 46,77 46,19.5 47,18.5 53.5,18.5 54.5,19.5 54.5,25.5 53,27 53,77.5 50.5,80 49,80
COM  (via drill 0.35)
  Top 0.5: C67.2 v65.5,161 | R83.1 v65.5,163 | IC17.2 v67.5,159 | IC18.2 v62,159 | C68.2 v60,161 | R84.1 v60,163 | R82.1 v71,163 | v71,161 C66.2 | IC16.2 v73,159 | C65.2 v76.5,161 | R81.1 v76.5,163 | IC15.2 v78.5,159 | IC14.2 v84,159 | C64.2 v82,161 | R80.1 v82,163
  pour Bottom: 57,174 57,162 60.5,158.5 85.5,158.5 86,159 86,174.5 85.5,175 58,175
D
  Top 1: D7.A 9.33,104.95 11.19,106.81 IC1.8 | IC1.8 IC1.7 | T1.1 11.56,108.68 IC1.8
  pour Top (no thermals): 14.5,106.5 14.5,109 14,109.5 12,109.5 12,113 11,113 11,109.5 10.5,109 10.5,106 14,106
DEBUG
  Top 0.2: TP7.1 74,111 75,112 76,112 77.5,113.5 IC22.31
DISP_A0  (via drill 0.35)
  Top 0.2: v62,137.3 55.7,137.3 52.65,140.35 X7.6 | IC22.17 69.5,120.5 68.8,121.2 64.8,121.2 63,123 62.5,123 62,123.5 v62,128.5
  Bottom 0.2: v62,128.5 v62,137.3
DISP_MOSI
  Top 0.2: IC22.80 85,132.7 85.8,133.5 85.8,134.3 84.6,135.5 58.5,135.5 58.27,135.27 X7.10
DISP_SCK
  Top 0.2: R106.1 86.85,136 54,136 53.5,136.5 50.04,136.5 X7.7
ENCODER_A
  Top 0.2: IC22.92 79,132.5 77.5,134 60,134 55,129 49.92,129 X7.13
ENCODER_B
  Top 0.2: IC22.93 78.5,132 77,133.5 60.5,133.5 54.65,127.65 X7.16
ENCODER_PB
  Top 0.2: IC22.95 77.5,132 76.5,133 61,133 54.5,126.5 50.12,126.5 X7.17
FB
  Top 0.4: IC4.4 10.55,153.6 R26.2 R25.1
GND  (via drill 0.35, 0.5)
  Top 0.3: IC22.74 90,128 v90.3,128.3 | IC22.27 75.5,115.65 v75.15,116 | IC22.94 v78,129 | R108.1 55.35,134.5
  Top 0.35: IC22.10 74.2,124 v74.5,124.3 | v75.5,131.7 IC22.99 | IC22.20 74.1,119 v74.5,118.6
  Top 0.4: v22.5,162 22.5,161.35 R100.1 | C76.2 v22.5,159.5 | v13.5,153 12.85,153 R26.1
  Top 0.5: IC23.2 59.37,140.87 v59.5,141 | IC23.3 60.63,140.87 v60.5,141 | IC23.1 58.09,139 v57,139 | IC23.7 59.37,143.13 v59.5,143 | v61,113.5 IC9.2 v61,111 | R49.1 v57,110.5 | C51.2 v57,108.5 | v57,112.5 57.85,112.5 C46.2 58.35,113 v59,113 | C47.2 v71.5,105.5 | v70,105.5 69.91,105.41 IC12.5 70.45,103.95 v70.5,104 | v64,107 C54.2 63.65,105.5 v63,105.5 62.35,105.5 C53.2 v62,107 | v87.5,104.5 87.5,105.15 C50.2 88,105.65 v88,106.5 | v99.5,104.5 99.5,105.15 C49.2 99.5,105.85 v99.5,106.5 | 89.06,104.94 v89,105 | R98.1 38,165.65 v38,166.5 | v40,166.5 40,165.65 C77.2 | C78.2 32,163.15 v32,164 | D16.1 31.5,160.55 v31.5,161.5 | D15.1 36,160.55 v36,161.5 | C79.2 42,158.35 v42,157.5 | 41,156.5 IC21.4 41.2,156.5 | R101.1 v30,156 | Q6.2 33,148.55 v33,149.5 | v39,151.5 39,150.85 C75.2 39,150.15 v39,149.5 | C83.2 37,146.65 v37,147.5 | C82.2 40,146.65 v40,147.5 | v100,119 100.85,119 R74.2 101.15,119 v102,119 103.35,119 Q5.2 | Q5.2 103.95,118.5 v104.5,118.5 | Q5.2 103,118.65 v103,118 | v31.5,134.5 31.5,133.6 IC3.3 31.5,133.4 v31.5,132.5 | R22.1 v34.5,137 | LED2.C v26,140 | C94.2 91.35,126 v90.5,126 | C96.2 v65,124.5 | XT1.4 68.95,127.5 v70,127.5 | XT1.2 67.05,125.5 v66,125.5 | v67,124 67,123.15 C97.2 | C73.2 v67,147 C72.2 | C71.2 v75,147 C70.2 | C69.2 v83,147 | IC15.3 77,152.77 v77,152 | IC14.3 82.5,152.77 v82.5,152 | IC16.3 72,152.73 v72,152 | IC17.3 66.5,152.73 v66.5,152 | IC18.3 61.5,152.23 v61.5,152 | C93.2 v60,124.5 | R113.1 v94.5,116 | v25.4,159.7 25.4,158.89 IC20.2 v25.5,158 | v12.5,159.5 12.45,159.45 IC4.1 12.65,158.5 v13,158.5 | 55.35,134.5 v54.5,134.5 | IC19.1 71.09,139.5 v70,139.5 | IC10.2 96.67,104.83 v96.5,105 | R54.1 92.15,108 v92.5,108
  Top 0.55: v99.5,112.5 D18.2
  Top 0.6: IC11.8 77.06,104.75 v77.3,105 | IC10.8 89.06,104.94 88.41,104.94 C50.2 | 41.2,156.5 v42.5,156.5 | X6.5 v104.5,110.5 | X6.3 104.73,109.23 v104.5,109 | C63.2 69.35,143 v70,143
  Top 0.7: v37.5,162.5 38.08,162.5 R97.1 38.08,163.5 v37.5,163.5
  Top 0.8: v57,142.5 56.35,142.5 C98.1 55.65,142.5 v55,142.5 | v61.9,140.8 v61.91,140.8 IC23.4 61.91,139 v62.9,139 | 41,156.5 v41,157 | v63,121.5 62.1,121.5 IC6.3 61.9,121.5 v61,121.5 | C26.2 v58.5,122.5 | C91.2 70.95,121.4 v70,121.4 | C95.2 85.5,112.15 v85.5,111.5 | v79.5,139 78.81,139 IC19.7 | C80.2 28.5,160.95 v28.5,159.5 | C74.2 v29.5,154 | v34,139 C25.2 | v9.5,156.5 8.65,156.5 C19.2 8.35,156.5 v7.5,156.5 6,156.5 C18.2 | C18.2 v6,154.5 | C18.2 v6,156.8 | C23.2 18,165.6 v18,167 | v17,167 17,166.4 C23.2 | C23.2 18,165.4 v18,164 18,162.6 C24.2 | C24.2 17,163.4 v17,164 17,164.6 C23.2 | v21.5,164 21.5,165.45 D17.A 21.5,165.55 v21.5,167 | C17.2 v6,165.5 | C17.2 5.9,164 v4.5,164 | C17.2 6.1,164 v7.5,164 | v41,141 41,139.29 IC5.1 41,138.91 v41,137.5 | C27.- 38,127 v37,127 | C27.- 39,127 v40,127 | C27.- v38.5,125 | v71.8,116 71.15,116 C85.2 70.85,116 v70,116 69.15,116 C84.2 | C24.2 18,162.4 v18,161
  Top 1: C20.2 v18,143.5
  Bottom 0.35: C89.2 75.85,131.35 v75.5,131.7
  Bottom 0.4: C90.2 74.5,118.15 v74.5,118.6 | C88.2 v75.15,116
  other vias: 46.5,158
  pour Bottom (rank 6): 1.5,131 1.5,167 2.5,168 14,168 25.5,179.5 49,179.5 53,175.5 53,159 58.5,153.5 84,153.5 87,150.5 87,146.5 100,133.5 107,133.5 108,132.5 108,103.5 107,102.5 59.5,102.5 38,124 23,124 20.5,126.5 20.5,128.5 19,130 2.5,130
GNDI  (via drill 0.3, 0.35, 0.45)
  Top 0.2: v67,30 67,30.5 72.5,30.5 v72.5,30
  Top 0.3: LED3.C v42,96.5
  Top 0.4: IC2.3 31,115.92 v31,114.5
  Top 0.5: C11.2 24.15,106.5 v25,106.5 | C10.2 21.35,102.5 v20.5,102.5 | R17.1 21.35,98.5 v20.5,98.5 | R14.1 v19,98.5 | C28.2 v91,71 | C32.2 v89,71 | C36.2 v87,71 | v83,70.8 R37.1 | C30.2 v81,71 | C34.2 v79,71 | C37.2 v75,71 | C31.2 v73,71 | C35.2 v70,71 | R39.1 81,75.85 v81,75 | v78,77 78,76.15 C38.2 | IC13.19 84.64,82.86 v84.5,83 | v74.5,90.5 74.48,90.48 IC13.10 73.56,88.56 v73.5,88.5 | IC13.9 75.75,90.25 v76,90.5 | IC13.8 77.03,90.47 v77,90.5 | C60.2 v88.5,84 | R8.1 60.35,20.5 v59.5,20.5 | v71,87 R67.1 | LED1.C 64.7,42.5 v66,42.5 | C59.2 71,90.15 v71,91 | v70.5,93.5 70.36,93.5 IC12.4 70,92.95 v70,91.5 | C57.1 65,90.15 v65,91 | IC11.9 76.86,93.5 v76.5,93.5 | IC10.9 88.85,93.5 v88.5,93.5 | C61.2 87.5,91.35 v87.5,92 | IC10.15 96.67,92.17 v96.5,92 96.5,91.35 C62.2 96.5,90.65 v96.5,90 | Q4.2 90.65,88.5 v90,88.5 | Q3.2 95.55,88.45 v94.8,89.2 | C56.2 60.65,91.5 v60,91.5 | C55.2 v60,93 | v42.5,75.5 42.5,74.45 C1.2 43.5,74.45 v43.5,75.5 | R2.1 v64.5,21.5 | D1.2 64.7,30 v65.5,30 | R12.1 v51.5,93
  Bottom 0.5: CY3.1 24.5,116.69 24,116.19 23.09,116.19
  Bottom 1: v25,106.5 25,107.5 19.72,112.78 T1.4 23.09,116.19 | NTC1.1 59.95,30.7 97.22,30.7 C45.2
  other vias: 56.5,25 57.5,25 58.5,25 56.5,22.5 57.5,22.5 55.5,24.5 55.5,23 67,26.5 68.5,26.5 67,28.5 74.5,30 74.5,28.5 74.5,27.5 72.5,27.5 70.5,27.5 70.5,30 28,75.5 27,76.5 27,75.5 29,75.5 29,76.5 28,76.5 27.5,76 28.5,76 32,110.5 36,105.5 36,104.5 38,104.5 38,105.5 37,105 37,106 41.5,104.5 41.5,106 44.5,106 44.5,104.5 36.5,110.5 40,110.5 58.5,28 58.5,26.5 103.5,37 102.5,37 104.5,37 102.5,36 103.5,36 104.5,36 105.5,38 105.5,37 101.5,38 101.5,37 101.5,36 105.5,36 57.5,28.5 58.5,22.5
  pour Bottom (rank 6): 20,72.5 37,72.5 45,64.5 45,19 46.5,17.5 64.5,17.5 65.5,18.5 65.5,22.5 70,27 103,27 108,32 108,67 106.5,68.5 96,68.5 93,71.5 93,80.5 96,83.5 100,83.5 102.5,86 102.5,92 100,94.5 57,94.5 34.5,117 23,117 19.5,113.5 19.5,111 17,108.5 17,107 14.5,104.5 6.5,104.5 2,100 2,87 5,84 15,84 18.5,80.5 18.5,74
  pour Top (no thermals): 55,28.5 55,22.5 55.5,22 58.5,22 59,22.5 59,28.5 58.5,29 55.5,29
  pour Top (no thermals): 66.5,30 67,30.5 74.5,30.5 75,30 75,27.5 74.5,27 70,27 69,26 67,26 66.5,26.5
  pour Top (no thermals): 24.5,77 24.5,75 31.5,75 31.5,77
  pour Top (no thermals): 33,108 33,104.5 33.5,104 44.5,104 45,104.5 45,106.5 40,111.5 32,111.5 30.5,110 30.5,108.5 30.7,108.3 32.7,108.3
  pour Top (no thermals): 102,39 105,39 106,38 106,36 105.5,35.5 101.5,35.5 101,36 101,38
  pour Bottom (no thermals): 88,58 88,54.5 93,54.5 93,58
  pour Bottom (no thermals): 99,59 99,51 107,51 107,59
IN_A
  Top 0.5: X5.1 82.5,166.05 R75.1
IN_A_OPTO
  Top 0.5: R75.2 84.85,165.4 R80.2 C64.1 85.27,160.58 IC14.1
IN_B
  Top 0.5: X5.2 77.5,165.55 R76.1
IN_B_OPTO
  Top 0.5: R76.2 79.35,165.4 R81.2 C65.1 79.77,160.58 IC15.1
IN_C
  Top 0.5: X5.3 72.5,165.95 R77.1
IN_C_OPTO
  Top 0.5: R77.2 73.85,165.4 R82.2 C66.1 74.27,160.58 IC16.1
IN_D
  Top 0.5: R78.1 66.5,165.55 66.5,167.25 67.5,168.25 X5.4
IN_D_OPTO
  Top 0.5: R78.2 68.35,165.4 R83.2 C67.1 68.77,160.58 IC17.1
IN_E
  Top 0.5: R79.1 62.95,167.8 62.5,168.25 X5.5
IN_E_OPTO
  Top 0.3: R84.2 62.85,163.15
  Top 0.5: IC18.1 63.27,160.58 C68.1 R84.2 | R79.2 61.5,165.05 61.5,164.5 62.85,163.15
INPUT_A_BUF  (via drill 0.35)
  Top 0.2: IC19.6 77.54,140.54 77.9,140.9 79.1,140.9 81,139 v82,139 | IC22.84 83,132.9 82,133.9 v82,134.5
  Bottom 0.2: v82,134.5 v82,139
INPUT_B_BUF  (via drill 0.35)
  Top 0.2: IC19.8 78.81,143.69 79,143.5 83,143.5 86,140.5 v86,139 | IC22.79 85.5,132.5 86.5,133.5 86.5,134.7 v86,135.2
  Bottom 0.2: v86,139 v86,135.2
INPUT_C_BUF  (via drill 0.35)
  Top 0.2: IC19.10 76.27,143.73 77,143 82.5,143 85,140.5 v85,139.5 | IC22.81 84.5,133.5 v85,134
  Bottom 0.2: v85,134 v85,139.5
INPUT_D_BUF  (via drill 0.35)
  Top 0.2: IC19.12 73.73,143.77 75,142.5 82,142.5 84,140.5 v84,139 | IC22.82 v84,134.5
  Bottom 0.2: v84,139 v84,134.5
INPUT_E_BUF  (via drill 0.35)
  Top 0.2: IC19.4 75,141 76,142 81.5,142 83,140.5 v83,139.5 | v83,134 83,133.88 83.5,133.38 IC22.83
  Bottom 0.2: v83,139.5 v83,134
L
  Bottom 2: X1.1 25.5,22.5 21.52,26.48 F1.1
L_FILT
  Top 2: L1.IN1 17.69,60.31 CY1.1 17.69,63.27 C4.1 20.8,70.62 D3.C D2.A
L_FUSED
  Top 1: 22.92,41 18.58,41 R3.2
  Top 1.5: 22.92,46.92 L1.OUT1
  Top 2: 22.92,46.92 C3.1 22.92,41
  Bottom 2: F1.2 9.5,43.02 20.38,32.14 24.19,32.14 R1.2 24.19,38.23 C3.1
N
  Top 1: R5.1 22.08,26.08 23.5,27.5 29.5,27.5 31.81,29.81 R1.1
  Top 1.5: 33.08,46.92 L1.OUT2
  Top 2: C3.2 33.08,46.92
  Bottom 2: X1.2 30.5,28.5 31.81,29.81 R1.1 31.81,38.23 C3.2
N$1
  Top 0.5: Q1.3 61.5,21.9 63,20.4 R7.2
N$2
  Top 0.3: R33.1 45.7,98.15 LED3.A
N$3
  Top 0.2: R61.2 99.65,88 97.5,88 97.45,88.05 Q3.1
N$4
  Top 0.5: LED4.C 97.9,122.25 R73.2
N$5
  Top 0.3: R43.2 R45.1 76,73.15 76,75.85 C38.1
N$6
  Top 0.3: IC8.12 77,65.94 R43.1 C37.1 74,69.15 74,71.15 R42.2
N$7
  Top 0.3: IC8.8 84.4,66.74 R37.2 84,69.15 84,71.15 R36.1
N$8
  Top 0.3: R36.2 84.85,70 R35.1
N$9
  Top 0.3: R35.2 86.2,66.95 IC8.7
N$10
  Top 0.2: R106.2 86,132.15 IC22.78
N$11
  Top 0.2: R109.1 82,132.35 IC22.86
N$12
  Top 0.5: Q1.1 64.25,24.6 R2.2 D1.1 64.5,28 63.05,29.45 C2.2
N$13
  Top 0.2: IC12.6 68.64,106.28 R52.1
N$14
  Top 0.5: R6.1 45,79.42 45,73 44.05,72.05 C1.1 43,70 45.5,67.5 45.5,19 46.5,18 55,18 55.5,18.5 55.5,20 56.5,21 58.5,21 60.5,23 60.5,24.55 Q1.2 60.55,26.1 C2.1
N$15
  Top 0.2: IC11.2 84.67,107.83 R55.2
N$16
  Top 0.2: IC11.3 83.41,108.56 R56.2
N$17
  Top 0.2: R57.2 82.14,108.02 IC11.4
N$22
  Top 0.3: R39.2 R38.1 85.15,75.7 R41.1
N$24
  Top 0.3: 41.85,163.43 R97.2 41.85,162.57 R99.1
  Top 0.7: 41.85,163.43 C77.1 42.5,166.15 X5.9
N$25
  Top 0.2: IC10.14 95.41,92.41 95,92 95,90.2 96,89.2 99.85,89.2 R61.1
N$26
  Top 0.4: IC20.3 24.55,160.3 R100.2
N$27
  Top 0.3: R99.2 39.1,160.5 D15.3 39.1,158.5 C79.1 39.5,157.85 39.5,156 40.37,155.13 IC21.3
N$29
  Top 0.5: R66.1 68.85,84 R64.1 R67.2
N$30
  Top 0.2: IC11.5 80.86,107.28 R58.2
N$31
  Top 0.2: R62.1 94.13,91.28 IC10.13
N$32
  Top 0.2: R59.2 79.59,106.56 IC11.6
N$33
  Top 0.2: IC11.7 78.33,105.83 R60.2
N$36
  Top 0.4: R95.1 22.15,156.3 C76.1 24.1,156.65 IC20.4
N$38
  Top 0.3: IC8.6 88,67.15 C36.1 86,69.15 86,71.15 R41.2 86.7,72.15 R44.1
N$42
  Top 0.2: R62.2 92.2,90.95 92.2,89 92.95,88.25 Q4.1
N$44
  Top 1: R3.1 R4.2
N$45
  Top 1: R4.1 R5.2
N$48
  Top 1: D9.1 23.2,96 R15.2
N$50
  Top 0.3: IC1.3 16.27,98.62 R14.2
N$52
  Top 0.3: IC1.4 21.16,100.69 R17.2 23.8,102.65 R16.1
N$53
  Top 1: R68.1 R70.1
N$54
  Top 1: R65.2 R68.2
N$55
  Top 0.3: R13.1 C10.1
N$56
  Top 0.3: IC3.2 33.6,134.5 33.5,134.5 32,136 32,136.65 R22.2 R21.1 28.85,134.35 R20.2
N$57
  Top 1: D7.C D8.C
N$59
  Top 1: R9.1 R10.2
N$60
  Top 0.2: C11.1 25.15,109.5 28.5,109.5 33.77,114.77 IC2.4
  Top 0.3: IC1.5 21.46,108.31 R13.2 C11.1
N$62
  Top 0.3: IC2.2 31.23,127.08 R19.1 | R19.1 30.5,128.65 C16.1 | R19.1 32.5,128.35 32.5,131.45 IC3.1
N$63
  Top 1: R11.2 R10.1
N$64
  Top 1: LED1.A R11.1
N$67
  Top 0.3: IC2.1 33.77,127.08 R19.2 R18.1
N$68
  Top 0.5: LED2.A 31.35,140 R24.1
N$69
  Top 0.3: R20.1 C16.2
N$75
  Top 0.4: R23.2 C21.1
N$77
  Top 0.2: R53.1 67.36,106.28 IC12.7
N$78
  Top 0.2: R52.2 69,110.35 C52.1 R50.1
N$79
  Top 0.2: R53.2 67,110.35 C52.2 65.15,108.5 R51.1
N$80
  Top 0.2: C48.2 62.39,112.65 IC9.3 61.95,110.7 R48.1 63.15,109.5 65,109.5 65.5,110 65.5,110.85 R50.2
N$81
  Top 0.2: IC9.1 59.85,112.01 R49.2 C51.1 R51.2
N$82
  Top 0.2: IC9.4 63.95,114.8 64,114.75 C48.1 64,113.9 64.6,113.9 65,113.5 | R48.2 65,111.65 65,113.5 | 65,113.5 70.35,113.5 R47.1
N$83
  Top 0.3: IC21.2 IC21.1 41.1,150.75 R104.1
N$84
  Top 0.3: IC21.5 35.09,156.41 33.6,157.9 D16.3 33.6,162.75 C78.1 R96.2 R98.2
N$85
  Top 0.5: R96.1 32.15,168.15 32.5,168.5 X5.11
N$86
  Top 0.3: IC21.7 33.22,153.87 R102.2 32.85,152.65 33.5,152 33.85,152 R105.1
N$87
  Top 0.3: R103.2 R102.1 31.15,154.3 R101.2 33.72,155.13 IC21.6
N$88
  Top 0.3: R103.1 30.9,149.05 Q6.3
N$90
  Top 0.8: C80.1 26.45,160.9 IC20.1
  Top 1.5: L8.1 27.55,163.55 26.55,162.55 C80.1
N$94
  Top 0.3: IC22.73 91.15,127.5 C94.1
N$95
  Top 0.3: IC22.49 86.5,112.85 C95.1
N$96
  Top 1: K1.P 95,150.39 X4.3
N$97
  Top 1: K1.O 105.14,145.86 100,151 X4.2
N$98
  Top 1: X4.1 105,151.39 K1.S
N$99
  Top 0.2: C97.1 XT1.3 70.95,125.4 R110.1
N$101
  Top 0.3: IC22.21 72.15,118.5 C91.1
  Top 0.8: R107.2 68.2,119.65 C91.1
N_COM  (via drill 0.5)
  Top 0.3: R44.2 82.15,73 78,73 | 78,73 77.85,73 R45.2 | R46.2 105.8,43.8 106.5,44.5 106.5,57 102,61.5 78.5,61.5 77.5,62.5 77.5,64 78.4,64.9 78.4,67.1 78,67.5 78,73
  Top 1: 87.25,51.5 94.55,51.5 97.25,48.8 IC8.26 100.25,43.8 R46.2 100.7,41 88.5,41 | 87.25,51.5 IC8.23 88.5,45.55 88.5,41 | 87.25,51.5 v79,51.5 v78,50.5 77.25,49.75 IC8.20 77.25,42.25 78.5,41 88.5,41
  other vias: 82,50.5 84,50.5 86,50.5 88,50.5 90,50.5 94,50.5 96,50.5 81,51.5 83,51.5 85,51.5 87,51.5 89,51.5 91,51.5 93,51.5 95,51.5
  pour Top (no thermals): 76.8,39 101,39 105,43 105,48 99,54 78,54 76.8,52.8
  pour Bottom: 78.5,52 77.5,51 77.5,50.25 77.75,50 96.25,50 96.5,50.25 96.5,51 95.5,52
N_FILT
  Top 2: L1.IN2 38.31,60.31 CY2.2 38.31,63.27 C4.2 35.2,70.62 D5.C D4.A
NRST  (via drill 0.35)
  Top 0.2: IC22.14 72,122 71.8,122.2 69.7,122.2 69.3,121.8 65.2,121.8 62.85,124.15 C93.1 63,124.5 v63,129 | v63.1,137.3 66.7,137.3 67,137 88.5,137 94,131.5 94,121.5 98.7,116.8 D18.3 100.04,113.45 100.45,113.04 X6.10
  Bottom 0.2: v63.1,137.3 63,137.2 v63,129
OC_BOOST
  Top 0.2: IC10.3 95.41,109.09 91,113.5 91,117 90.5,117.5 IC22.53
OE
  Top 0.2: IC22.52 90,117 90.5,116.5 90.5,111.35 R54.2 94.13,107.72 IC10.4
OSC_IN
  Top 0.2: IC22.12 72.28,123 72,123.28 72,126 71.5,126.5 68.25,126.5 XT1.1 65.25,127.6 C96.1
OSC_OUT
  Top 0.2: R110.2 72.15,122.5 IC22.13
PE  (via drill 0.35)
  Bottom 1: CY2.1 28,61 28,51.5 35.5,51.5 39.5,47.5 39.5,25 X1.3
  other vias: 22.5,12 22,2 22,7 27,12 27,7 27,2 32,2 32,7 33,11.5 37,11.5 37,7 37,2 42,2 42,7 42,12 47,12 47,7 47,2 52,2 52,12 73,2 73,7 73,12 79,11.5 78,7 78,2 83,2 83,7 82,11.5 88,12 88,7 88,2 58,2 58,12 63,12 63,7 63,2 68,2 68,7 68,12 37,18.5 73,17
  pour Bottom (no thermals): 34.5,22.5 34.5,15.5 32.5,13.5 21.5,13.5 21,13 21,2 arc90 22,1 88,1 arc90 89,2 89,13 88.5,13.5 75.5,13.5 74,15 74,22.5 73,22.5 70,19.5 70,15.5 68,13.5 42,13.5 40,15.5 40,49 37,52 30.5,52 29.5,53 29.5,59.5 30,60 31,60 31.5,60.5 31.5,61.5 31,62 25,62 24.5,61.5 24.5,60.5 25,60 26,60 26.5,59.5 26.5,52 28.5,50 35.5,50 37.5,48 37.5,25.5
  pour Top (no thermals): 32.5,13.5 21.5,13.5 21,13 21,2 arc90 22,1 88,1 arc90 89,2 89,13 88.5,13.5 75.5,13.5 74,15 74,22.5 73,22.5 70,19.5 70,15.5 68,13.5 42,13.5 38,17.5 38,21.5 36.5,23 35,23 34.5,22.5 34.5,15.5
RELAY  (via drill 0.35)
  Top 0.2: v91.7,122.7 90.7,122.7 90.5,122.5 IC22.63 | v94.8,122.7 94.8,121.85 96.15,120.5 97,120.5 97.15,120.35 R72.1
  Bottom 0.2: v94.8,122.7 v91.7,122.7
RELAY_DRAIN
  Top 0.5: R73.1 99.35,122.5 102.7,122.5 103.7,123.5 D14.2
  Top 0.8: Q5.3 105.6,122.1 D14.2 104.5,123.8 104.5,127.11 K1.2
RELAY_R
  Top 0.2: R72.2 99.7,120.85 R74.1 103.3,120.85 Q5.1
SCL  (via drill 0.35)
  Top 0.2: IC23.6 60.63,142.87 | 60.63,142.87 61.5,142 63.5,142 68,137.5 89,137.5 94.8,131.7 v94.8,124.9 | v91.7,124.9 90.9,124.9 90.5,124.5 IC22.67 | X7.4 53.16,141 57,141 58,142 59.77,142 60.63,142.87
  Top 0.3: IC23.6 60.63,146.72 R114.1
  Bottom 0.2: v91.7,124.9 v94.8,124.9
SDA  (via drill 0.35)
  Top 0.2: IC23.5 61.91,144 63,144 69,138 89.5,138 95.6,131.9 95.6,124.6 v94.8,123.8 | IC22.66 90.5,124 90.7,123.8 v91.7,123.8 | X7.3 50.14,144.3 52.1,144.3 57.8,150 59.5,150 60.35,149.15 R111.1
  Top 0.3: R111.1 61.5,147.85 61.5,145.5 61.91,145.09 IC23.5
  Bottom 0.2: v94.8,123.8 v91.7,123.8
SEC_OUT
  Top 2: D11.A 9.45,130.47 T1.9
SS_FET
  Top 0.5: R7.1 R8.2 57.87,18.65 Q2.1
SW
  Top 0.4: C21.2 13.4,160.45 10.95,160.45
  Top 0.7: IC4.2 11.5,159.9 10.95,160.45 L4.P$2
SWDCLK
  Top 0.2: IC22.76 87,131 91,131 93.5,128.5 93.5,121 94.5,120 R113.2 96.25,117.1 96.25,113.5 D18.4 96.55,113.45 97.5,112.5 97.5,111.5 98.5,110.5 99.5,110.5 100.77,109.23 X6.4
SWDIO
  Top 0.2: X6.2 101.04,107.96 99.5,109.5 98.5,109.5 97,111 97,112 96.5,112.5 D18.5 95.5,112.5 92.7,115.3 92.7,116.45 R112.1 93,118.15 93,119.5 92.5,120 92.5,126.7 92.2,127 IC22.72
SWO  (via drill 0.35)
  Top 0.2: IC22.89 80.5,129.5 80.7,129.3 87.3,129.3 88.5,130.5 90.5,130.5 93,128 93,120.5 93.5,120 93.5,115.5 94.5,114.5 v95.5,114.5 | X6.6 100.5,110.5 99.45,111.55 D18.1 98.5,111.55 98,112.05 98,113.5 v97,114.5
  Bottom 0.2: v95.5,114.5 v97,114.5
U  (via drill 0.6)
  Top 1: X3.2 78.5,36 v79,36.5
  Bottom 1: v79,36.5 78.05,36.5 L5.2
U_H
  Top 0.2: IC22.40 82,113.5 80.5,112 80.5,109.7 80.3,109.5 78.35,109.5 R59.1
U_H_ENA
  Top 0.2: R27.1 73,76 75.5,78.5 77,78.5 78.3,79.8 IC13.14
U_H_FILT
  Top 0.3: IC8.14 73,66.34 C31.1 72,69.15 72,71.15 R27.2
U_H_ISO
  Top 0.2: IC13.6 79.56,93.67 IC11.11
U_L
  Top 0.2: IC22.32 78,112.85 R60.1
U_L_ENA
  Top 0.2: R30.1 70,75 74.5,79.5 76,79.5 77.03,80.53 IC13.13
U_L_FILT
  Top 0.3: IC8.16 C35.1 71,69.15 71,71.15 R30.2
U_L_ISO
  Top 0.2: IC11.10 78.33,88.59 IC13.7
U_OUT
  Bottom 1: C39.2 74.75,47.2 IC8.19 74.75,41.7 L5.1
UART_RX
  Top 0.2: R109.2 78.15,134.5 59.5,134.5 56.5,131.5 49.96,131.5 X7.11
UART_TX
  Top 0.2: IC22.87 81.5,131.25 81,131.75 81,133.5 79.5,135 59,135 56.65,132.65 R108.2 55.42,132.73 X7.12
V  (via drill 0.6)
  Top 1: X3.3 83.5,35.5 v84.5,36.5
  Bottom 1: v84.5,36.5 83.55,36.5 L6.2
V_AUX
  Top 1: R15.1 18.55,96.5 C12.+ 13.73,96.54 IC1.2
V_BUS_MON
  Top 0.2: R47.2 73.85,113 76,113 76.5,113.5 IC22.29
  Top 0.5: R47.2 C47.1
V_H
  Top 0.2: R57.1 81.5,111.5 83,113 IC22.42
V_H_ENA
  Top 0.2: IC13.16 80.84,78.84 80,78 80,74.85 R28.1
V_H_FILT
  Top 0.3: IC8.10 81,65.94 C30.1 82,69.15 82,71.15 R28.2
V_H_ISO
  Top 0.2: IC11.13 82.14,88.59 IC13.4
V_L
  Top 0.2: R58.1 IC22.35
V_L_ENA
  Top 0.2: IC13.15 79.56,79.06 79,78.5 R31.1
V_L_FILT
  Top 0.3: R31.2 80,71.15 80,69.15 C34.1 79.3,67.85 79.3,63.5 IC8.11
V_L_ISO
  Top 0.2: IC11.12 80.86,88.59 IC13.5
V_OUT
  Bottom 1: IC8.22 83.01,42.5 C40.2 83,42.45 L6.1
VBUS
  Top 1: C5.+ 57.31,61.92 R9.2 R70.2
  Top 1.7: IC8.18 72.25,36.97 C45.1
  Top 2: D2.C D4.C 30.8,83.8 33.5,86.5 34.3,86.5 D6.A 34.7,86.5 TP1.TP 51,86.5 57.31,80.19 C7.+
  Top 3: C7.+ C5.+ C6.+ 61.31,36.5 66.78,36.5 68.78,34.5 C45.1
  pour Top (rank 2, no thermals): 70,36 70.5,36.5 70.5,43 72,44.5 72.5,44.5 73.5,43.5 73.5,35 71.5,33 68.5,33 68.5,36
VBUS_FILT
  Top 1.5: L2.2 24.04,92.04 C8.+ 33.16,92.04 D6.C
VBUS_MON
  Top 0.5: R63.2 67.15,86 C58.1 67.15,89.7 C57.2 67.36,90.52 IC12.2
VBUS_MON_ATT
  Top 0.5: R65.1 66.43,81.85 67,81.85 R66.2 67.15,84.15 R63.1
VBUS_MON_NEG
  Top 0.5: R64.2 68.85,86 C58.2 68.85,89.7 C59.1 68.64,90.52 IC12.3
VCC  (via drill 0.35)
  Top 1: v92.5,60.5 v81.5,60.5 v74,60.5 71.5,60.5 68.5,63.5 68.5,76.05 R34.2
  Bottom 0.8: C42.1 75.15,62.95 IC8.13 | C43.1 82.65,63.15 IC8.9 | C44.1 93.65,62.95 IC8.3 | v92.5,60.5 91.45,60.5 D13.C
  Bottom 1: C44.1 v92.5,60.5 | v81.5,60.5 C43.1 | C42.1 v74,60.5
VDD
  Top 0.3: R18.2 30.2,131.45 30.2,133.3 30,133.5 17,133.5 16.96,133.46
  Top 1.5: C14.+ 16.96,133.46 16,132.5 D11.C
  Top 1.8: L3.2 14.46,139.5 C14.+
  pour Top (no thermals): 16,131 12.5,131 12.5,134 13.5,134 17,137.5 17.5,137.5 18,137 18,133
VDD_FILT
  Top 0.2: IC4.5 11.5,156.85 10.55,157.8 IC4.3
  Top 0.4: TP6.1 3.5,154.5
  Top 0.5: C15.+ 6.48,148.5 7.5,148.5 14,142 16.5,142 19.5,139 25.15,139 R21.2
  Top 1.5: C17.1 6,160
  Top 1.8: L3.1 4.98,141.02 C15.+ 3.5,148.48 3.5,154.5 3.5,158.5 5,160 6,160 | C17.1 C18.1
  pour Top (no thermals): 3,159 10.8,159 10.8,157.5 5,157.5 4,156.5 3,156.5
VIN_ADC
  Top 0.2: C83.1 36.95,145 41.5,145 43,143.5 43,123 49.6,116.4 64.3,116.4 66.2,114.5 73,114.5 74.3,115.8 74.3,116.7 74,117 IC22.24
  Top 0.3: R105.2 35.45,148.6 C83.1
VREF
  Top 0.8: IC6.2 63.55,120 R107.1
W  (via drill 0.6)
  Top 1: X3.4 v88.5,36.5
  Bottom 1: L7.2 89.45,36.5 v88.5,36.5
W_H
  Top 0.2: IC22.44 84,111.85 R55.1
W_H_ENA
  Top 0.2: R29.1 91,75 87,79 84.5,79 83.38,80.12 IC13.18
W_H_FILT
  Top 0.3: IC8.4 91,66.34 C28.1 90,69.15 90,71.15 R29.2
W_H_ISO
  Top 0.2: IC11.15 84.67,88.59 IC13.2
W_L
  Top 0.2: R56.1 IC22.43
W_L_ENA
  Top 0.2: R32.1 89,76 87,78 84,78 82.11,79.89 IC13.17
W_L_FILT
  Top 0.3: R32.2 88,71.15 88,69.15 C32.1 89.8,67.35 IC8.5
W_L_ISO
  Top 0.2: IC11.14 83.41,88.59 IC13.3
W_OUT
  Bottom 1: IC8.25 93.01,42.5 C41.2 93,42.45 93,41.5 90.45,38.95 L7.1
(copper drawn outside any net)
  shapes: Bottom circle x39, Top circle x35

## Text on the board
Top: TOP | RevA
Bottom: BOT
tPlace: +5V | Analog IN | GND | 4-20mA IN | +5V | GND | COM | IN-E | IN-D | IN-C | IN-B | IN-A | +5V BUCK | FAN | EEPROM | COLD | UI | +3.3V | +5V LDO | HOT! | U_L | U_H | U_L | V_H | W_L | W_H | DBG | SWD | +HV | +5V | GNDI | FLYBACK | GNDI | +15V | VBUS | ADAM+ / Mini VFD / Feb. 25 | ADAM+ | L | N | PE | PE | U | V | W | AC INPUT | MOTOR | HIGH / VOLTAGE! | HIGH / VOLTAGE!